# EAGLE design Base Arduino clone (EAGLE 7.1.0)
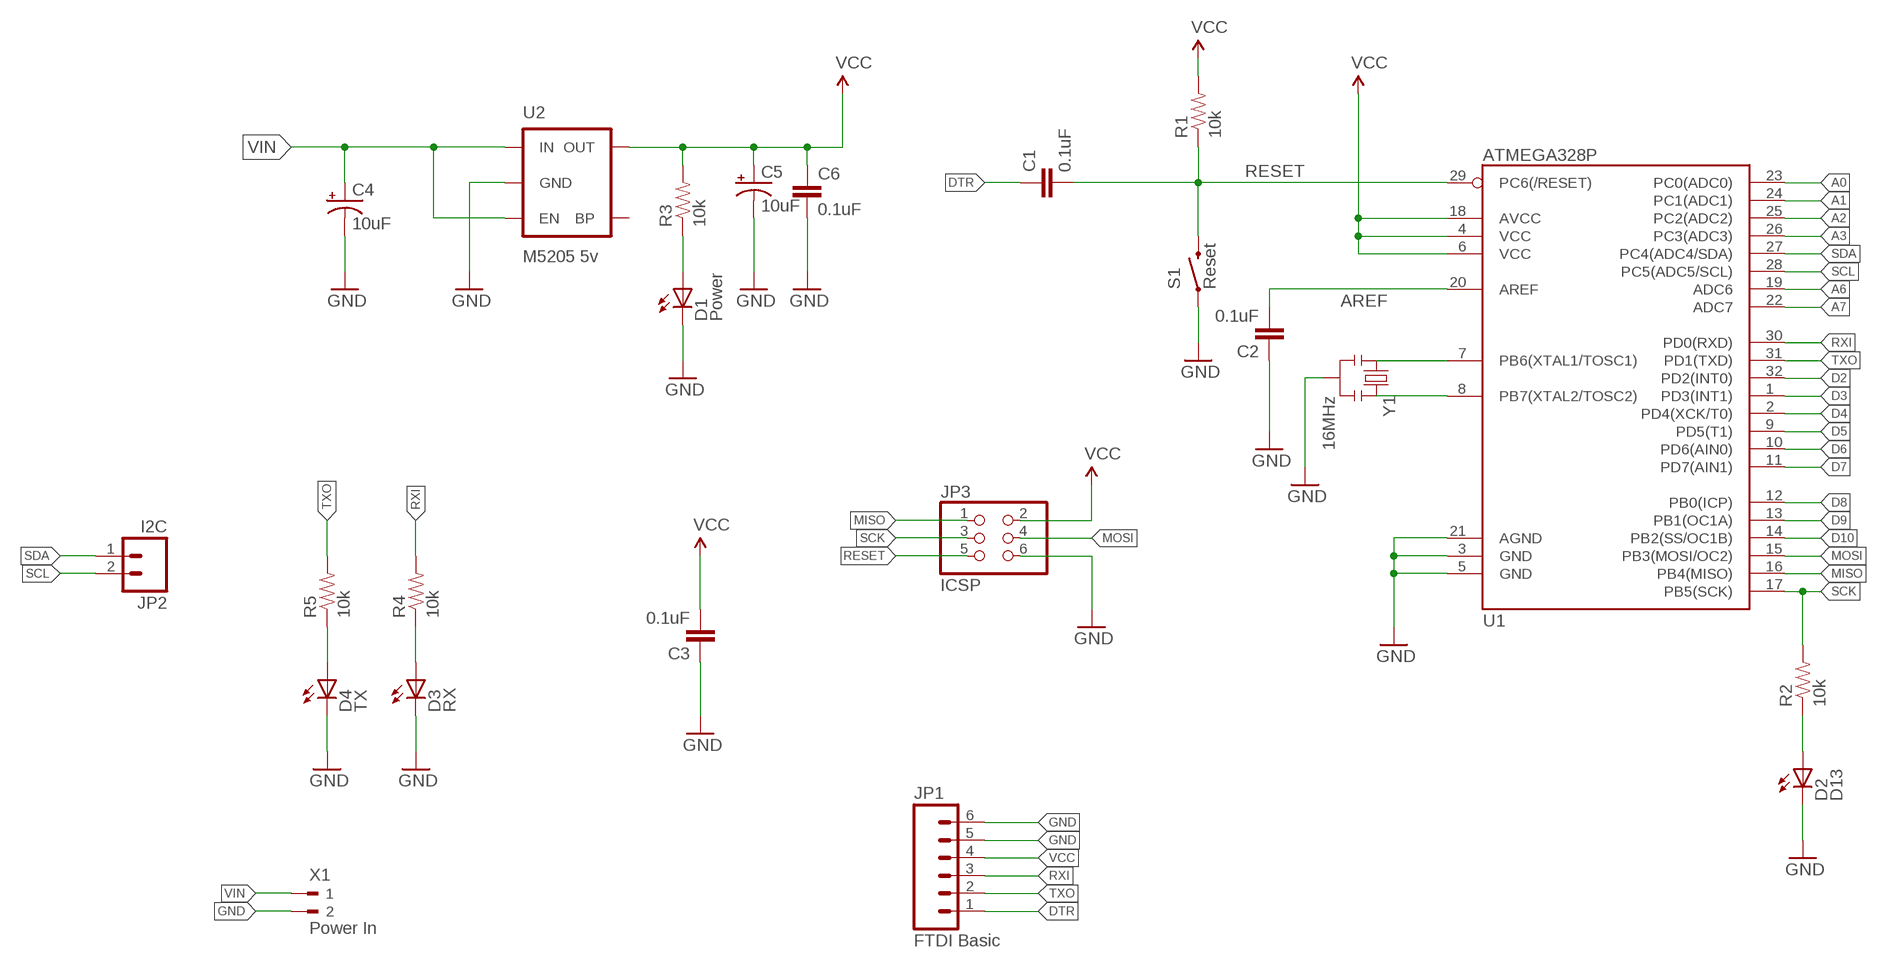
[diagram p0: schematic, sheet 1]

## Parts
C1  0.1uF  CAP0603-CAP  [0603-CAP]
C2  0.1uF  CAP0603-CAP  [0603-CAP]
C3  0.1uF  CAP0603-CAP  [0603-CAP]
C4  10uF  CAP_POL1206  [EIA3216]
C5  10uF  CAP_POL1206  [EIA3216]
C6  0.1uF  CAP0603-CAP  [0603-CAP]
D1  Power  LED-RED0603  [LED-0603]
D2  D13  LED-RED0603  [LED-0603]
D3  RX  LED-GREEN0603  [LED-0603]
D4  TX  LED-RED0603  [LED-0603]
JP1  FTDI Basic  M06SIP  [1X06]
JP2  I2C  M02PTH  [1X02]
JP3  ICSP  PINHD-2X3  [2X03]
R1  10k  RESISTOR0603-RES  [0603-RES]
R2  10k  RESISTOR0603-RES  [0603-RES]
R3  10k  RESISTOR0603-RES  [0603-RES]
R4  10k  RESISTOR0603-RES  [0603-RES]
R5  10k  RESISTOR0603-RES  [0603-RES]
S1  Reset  SWITCH-MOMENTARY-2SMD  [TACTILE_SWITCH_SMD]
U1  ATMEGA328P  ATMEGA328_SMT  [TQFP32-08]
U2  M5205 5v  MIC52055V  [SOT23-5]
X1  Power In  180G-2  [180G-2]
Y1  16MHz  RESONATOR16MHZ  [RESONATOR-SMD]

## Nets
A0: U1.23(PC0(ADC0))
A1: U1.24(PC1(ADC1))
A2: U1.25(PC2(ADC2))
A3: U1.26(PC3(ADC3))
A6: U1.19(ADC6)
A7: U1.22(ADC7)
AREF: C2.2 U1.20(AREF)
D2: U1.32(PD2(INT0))
D3: U1.1(PD3(INT1))
D4: U1.2(PD4(XCK/T0))
D5: U1.9(PD5(T1))
D6: U1.10(PD6(AIN0))
D7: U1.11(PD7(AIN1))
D8: U1.12(PB0(ICP))
D9: U1.13(PB1(OC1A))
D10: U1.14(PB2(SS/OC1B))
DTR: C1.1 JP1.1
GND: C2.1 C3.1 C4.C(-) C5.C(-) C6.2 D1.C D2.C D3.C D4.C JP1.5 JP1.6 JP3.6 S1.1 U1.3(GND) U1.5(GND) U1.21(AGND) U2.2(GND) X1.2 Y1.2
MISO: JP3.1 U1.16(PB4(MISO))
MOSI: JP3.4 U1.15(PB3(MOSI/OC2))
N$1: U1.7(PB6(XTAL1/TOSC1)) Y1.1
N$2: U1.8(PB7(XTAL2/TOSC2)) Y1.3
N$3: D1.A R3.1
N$4: D2.A R2.1
N$5: D3.A R4.1
N$6: D4.A R5.1
RESET: C1.2 JP3.5 R1.1 S1.3 U1.29(PC6(/RESET))
RXI: JP1.3 R4.2 U1.30(PD0(RXD))
SCK: JP3.3 R2.2 U1.17(PB5(SCK))
SCL: JP2.2 U1.28(PC5(ADC5/SCL))
SDA: JP2.1 U1.27(PC4(ADC4/SDA))
TXO: JP1.2 R5.2 U1.31(PD1(TXD))
VCC: C3.2 C5.A(+) C6.1 JP1.4 JP3.2 R1.2 R3.2 U1.4(VCC) U1.6(VCC) U1.18(AVCC) U2.5(OUT)
VIN: C4.A(+) U2.1(IN) U2.3(EN) X1.1
Unconnected: U2.4(BP)

## Library data of the parts
C1-C3 C6 = SparkFun-Passives:CAP: Capacitor Standard 0603 ceramic capacitor, and 0.1" leaded capacitor.
C4 C5 = SparkFun-Passives:CAP_POL: Capacitor Polarized These are standard SMD and PTH capacitors. Normally 10uF, 47uF, and 100uF in electrolytic and tantalum varieties. Always verify the external diameter of the through hole cap, it varies with capacity, voltage, and manufacturer. The EIA devices should be standard.
D1 D2 D4 = SparkFun-LED:LED-RED: Assorted Red LEDs LilyPad 1206- DIO-09912 1206- DIO-00809 0603- DIO-00819; PROD_ID: DIO-00819; VALUE: RED
D3 = SparkFun-LED:LED-GREEN: Various green LEDs Green LEDs used in SFE Production 0603- DIO-00821 LARGE- DIO-00862 LILYPAD- DIO-09910; PROD_ID: DIO-00821; VALUE: GREEN
JP1 = SparkFun-Connectors:M06: Header 6 Standard 6-pin 0.1" header. Use with straight break away headers (SKU : PRT-00116), right angle break away headers (PRT-00553), swiss pins (PRT-00743), machine pins (PRT-00117), and female headers (PRT-00115). Molex polarized connector foot print use with SKU : PRT-08094 with associated crimp pins and housings. NOTES ON THE VARIANTS LOCK and LOCK_LONGPADS... This footprint was designed to help hold the alignment of a through-hole component (i.e. 6-pin header) while soldering it into place. You may notice that each hole has been shifted either up or down by 0.005 of an inch from it's more standard position (which is a perfectly straight line). This slight alteration caused the pins (the squares in the middle) to touch the edges of the holes. Because they are alternating, it causes a "brace" to hold the component in place. 0.005 has proven to be the perfect amount of "off-center" position when using our standard breakaway headers. Although looks a little odd when you look at the bare footprint, once you have a header in there, the alteration is very hard to notice. Also,if you push a header all the way into place, it is covered up entirely on the bottom side. This idea of altering the position of holes to aid alignment will be further integrated into the Sparkfun Library for other footprints. It can help hold any component with 3 or more connection pins.
JP2 = SparkFun-Connectors:M02: Standard 2-pin 0.1" header. Use with - straight break away headers ( PRT-00116) - right angle break away headers (PRT-00553) - swiss pins (PRT-00743) - machine pins (PRT-00117) - female headers (PRT-00115) Molex polarized connector foot print use with: PRT-08233 with associated crimp pins and housings. 2.54_SCREWTERM for use with PRT-10571. 3.5mm Screw Terminal footprints for PRT-08084 5mm Screw Terminal footprints for use with PRT-08433
JP3 = SparkFun-Connectors:PINHD-2X3: PIN HEADER
R1-R5 = SparkFun-Passives:RESISTOR: Resistor Basic schematic elements and footprints for 0603, 1206, and PTH resistors.
S1 = SparkFun-Electromechanical:SWITCH-MOMENTARY-2: Various NO switches- pushbuttons, reed, etc; PROD_ID: SWCH-08247
U1 = SparkFun-DigitalIC:ATMEGA328_SMT: 32-Pin Atmega328 part Commonly used on Arduino compatible boards Available in QFP and QFN packages TQFP is IC-09069 QFN is non-stock; PROD_ID: IC-09069
U2 = SparkFun-PowerIC:MIC5205: MIC5205 150mA vreg 3.3V - VREG-00822 5V - VREG-00823; PROD_ID: VREG-00823
X1 = con-weidmueller-sl35:180G-2: WEIDMUELLER CLAMP CONNECTOR; OC_FARNELL: unknown; OC_NEWARK: unknown
Y1 = SparkFun-FreqCtrl:RESONATOR: Resonator Small SMD resonator. Used, eg, on the Arduino Pro/ Pro Mini boards. 8MHz- XTAL-08895 16MHz- XTAL-08900; PROD_ID: XTAL-08900

## Board
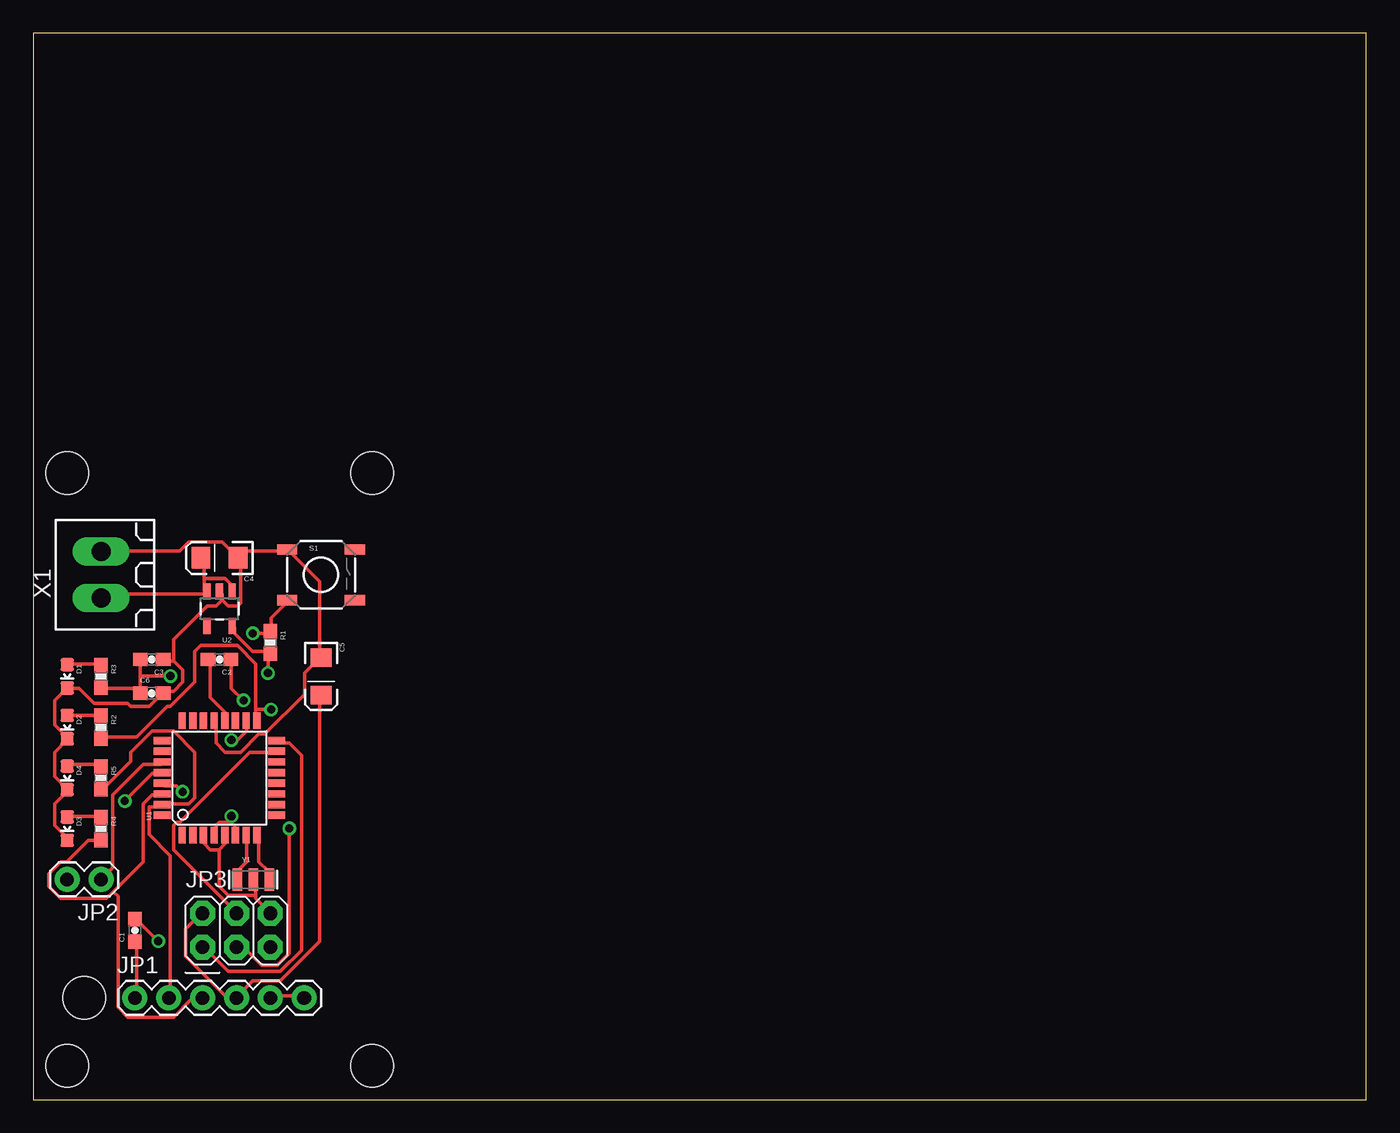
[diagram p1: board, top side]
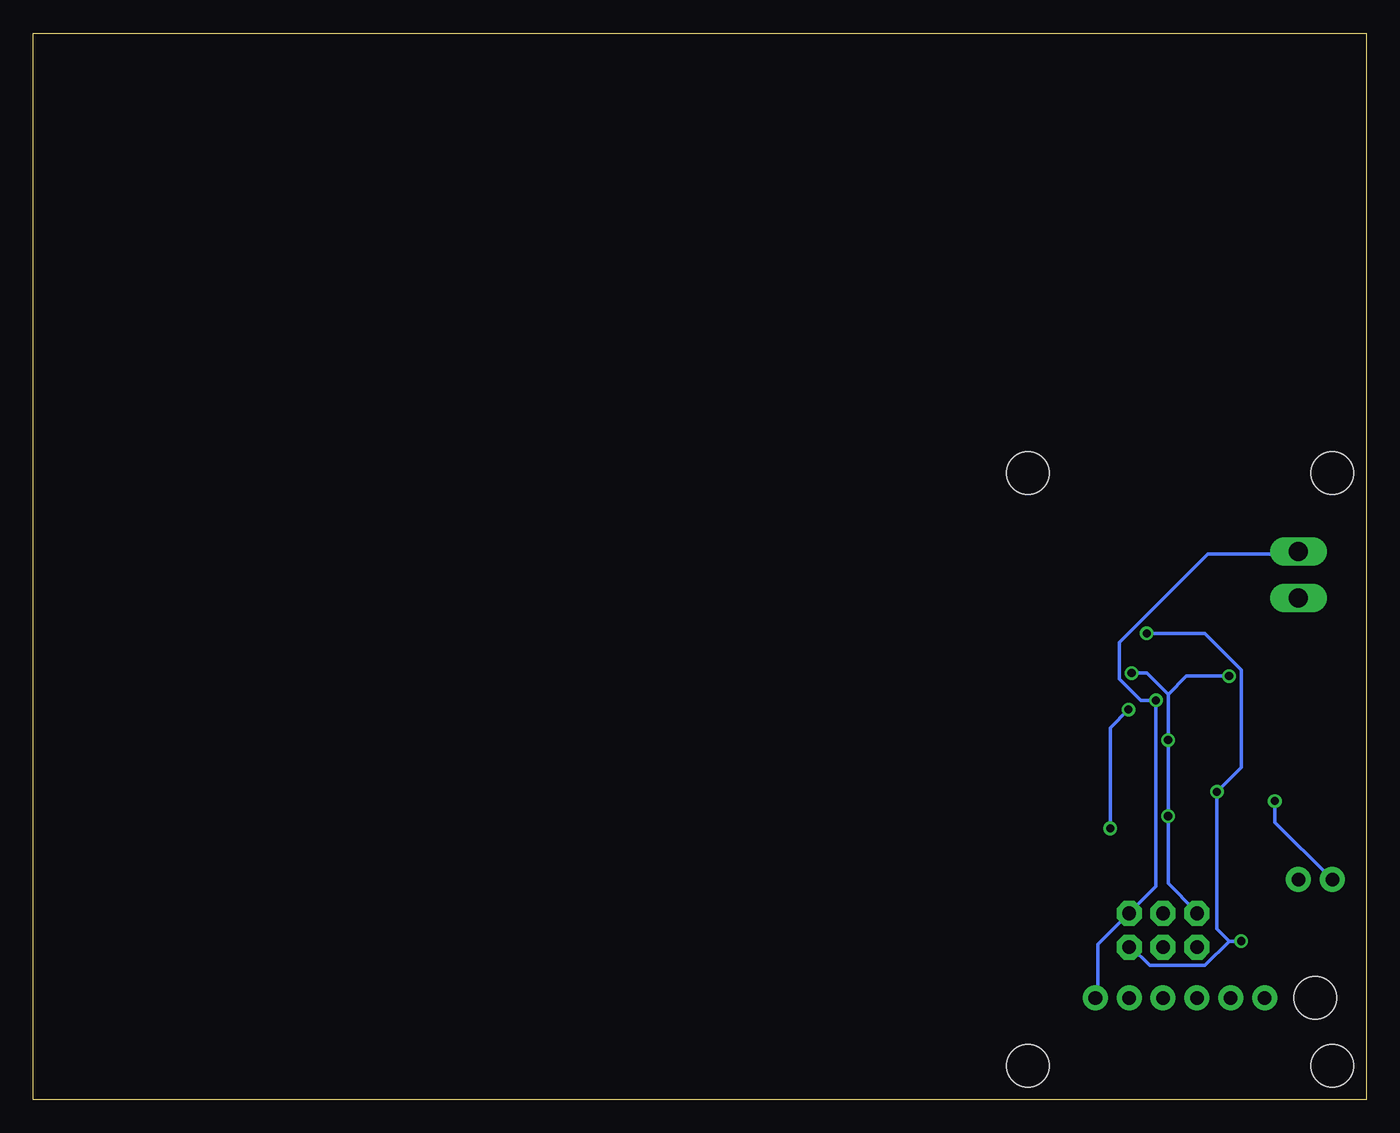
[diagram p2: board, bottom side, seen from below]

Size 100 x 80 mm. Coordinates in mm from the lower left corner, seen from the top.
Outline: 0,0 100,0 100,80 0,80 0,0
Copper layers (1*16): Top 0.035mm / dielectric 1.5mm / Bottom 0.035mm
Design rules "default": minimum track width 10mil, minimum drill 24mil, track to track 8mil, track to pad 8mil, pad to pad 8mil, via to via 8mil, smd to smd 8mil, copper to edge 40mil, drill to drill 8mil, minimum pad ring 10mil, minimum via ring 8mil, stop-mask expansion 4mil, vias tented up to drill 0mil, thermal gap 10mil
Holes 3.2 mm at 2.54,2.54 25.4,2.54 2.54,46.99 25.4,46.99 3.81,7.62

### Footprints (pad centres in the part's own frame; a part is rotated, then mirrored left to right if it is on the bottom)
0603-CAP = smd 1.1 x 1: 1 -0.85,0; 2 0.85,0
EIA3216 = smd 1.4 x 1.6: A 1.4,0; C -1.4,0
LED-0603 = smd 1 x 1: A 0,-0.877; C 0,0.877
1X06 = drill 1.016 pad 1.88: 1 0,0; 2 2.54,0; 3 5.08,0; 4 7.62,0; 5 10.16,0; 6 12.7,0
1X02 = drill 1.016 pad 1.88: 1 0,0; 2 2.54,0
2X03 = drill 1.016 pad 1.88 octagon: 1 -2.54,-1.27; 2 -2.54,1.27; 3 0,-1.27; 4 0,1.27; 5 2.54,-1.27; 6 2.54,1.27
0603-RES = smd 1.1 x 1: 1 -0.85,0; 2 0.85,0
TACTILE_SWITCH_SMD = smd 1.524 x 0.762: 1 -2.54,1.905; 2 2.54,1.905; 3 -2.54,-1.905; 4 2.54,-1.905
TQFP32-08 = smd 1.27 x 0.559: 1 -4.293,2.8; 2 -4.293,2; 3 -4.293,1.2; 4 -4.293,0.4; 5 -4.293,-0.4; 6 -4.293,-1.2; 7 -4.293,-2; 8 -4.293,-2.8; 17 4.293,-2.8; 18 4.293,-2; 19 4.293,-1.2; 20 4.293,-0.4; 21 4.293,0.4; 22 4.293,1.2; 23 4.293,2; 24 4.293,2.8 | smd 0.559 x 1.27: 9 -2.8,-4.293; 10 -2,-4.293; 11 -1.2,-4.293; 12 -0.4,-4.293; 13 0.4,-4.293; 14 1.2,-4.293; 15 2,-4.293; 16 2.8,-4.293; 25 2.8,4.293; 26 2,4.293; 27 1.2,4.293; 28 0.4,4.293; 29 -0.4,4.293; 30 -1.2,4.293; 31 -2,4.293; 32 -2.8,4.293
SOT23-5 = smd 0.55 x 1.2: 1 -0.95,-1.3; 2 0,-1.3; 3 0.95,-1.3; 4 0.95,1.3; 5 -0.95,1.3
180G-2 = drill 1.422 long: 1 -1.75,0; 2 1.75,0
RESONATOR-SMD = smd 0.7 x 1.7: 1 -1.2,0; 2 0,0; 3 1.2,0

### Placement (x,y rotation side)
C1  7.62,12.7 90 top
C2  13.97,33.02 180 top
C3  8.89,33.02 180 top
C4  13.97,40.64 180 top
C5  21.59,31.75 270 top
C6  8.89,30.48 0 top
D1  2.54,31.75 180 top
D2  2.54,27.94 180 top
D3  2.54,20.32 180 top
D4  2.54,24.13 180 top
JP1  7.62,7.62 0 top
JP2  5.08,16.51 180 top
JP3  15.24,12.7 0 top
R1  17.78,34.29 270 top
R2  5.08,27.94 270 top
R3  5.08,31.75 270 top
R4  5.08,20.32 270 top
R5  5.08,24.13 270 top
S1  21.59,39.37 0 top
U1  13.97,24.13 90 top
U2  13.97,36.83 180 top
X1  5.08,39.37 90 top
Y1  16.51,16.51 0 top

### Tracks (layer width: path | path; a pad name or v marks a point on that pad's centre or on a via)
AREF
  Top 0.254: C2.2 13.26,32.92 13.26,30.18 14.4,29.03 14.4,28.57 U1.20
DTR
  Top 0.254: C1.1 7.77,11.66 7.77,7.77 JP1.1
GND  (via drill 0.61)
  Top 0.254: JP1.5 17.83,7.77 20.12,7.77 JP1.6 | 13.95,18.75 13.26,18.75 12.8,19.2 12.8,19.66 U1.3 | 13.95,18.75 14.4,19.2 14.4,19.66 U1.5 | v15.77,29.95 14.86,30.86 14.86,32.92 C2.1 | 16.69,15.32 16.69,15.09 17.6,14.17 JP3.6 | 16.69,15.32 16.69,16.46 Y1.2 | 13.95,18.75 13.95,16 14.63,15.32 16.69,15.32 | U1.21 13.72,28.35 13.72,26.75 14.4,26.06 15.54,26.06 16.92,27.43 17.37,27.43 20.34,30.4 20.34,32 21.49,33.15 C5.C 21.49,33.38 21.49,38.86 19.2,41.15 S1.1 18.97,41.15 16,41.15 15.54,40.69 C4.C | D3.C 2.52,19.66 1.6,20.57 1.6,22.17 2.52,23.09 D4.C 2.52,23.32 1.6,24.23 1.6,26.06 2.52,26.98 D2.C 2.52,27.2 1.6,28.12 1.6,29.95 2.52,30.86 D1.C 2.74,30.86 3.43,30.86 4.57,29.72 7.09,29.72 7.32,29.49 8.69,29.49 9.6,30.4 C6.2 9.83,30.63 10.52,30.63 11.2,31.32 11.2,32.23 10.52,32.92 | 10.52,32.92 9.83,32.92 C3.1 | 14.17,37.49 14.17,37.95 U2.2 | 14.17,37.49 14.63,37.03 15.32,37.03 15.54,37.26 15.54,40.46 C4.C | 10.52,32.92 10.52,34.52 13.03,37.03 13.72,37.03 14.17,37.49 | X1.2 5.26,41.15 10.97,41.15 11.66,41.83 14.17,41.83 15.32,40.69 C4.C
  Bottom 0.254: JP1.6 20.12,7.77 20.12,11.66 17.83,13.95 JP3.6 17.6,14.17 15.77,16 v15.77,29.95 16.92,29.95 18.52,31.55 18.52,34.29 11.89,40.92 5.26,40.92 X1.2
MISO
  Top 0.254: U1.16 18.29,26.75 19.2,26.75 20.12,25.83 20.12,11.2 18.52,9.6 14.63,9.6 12.8,11.43 JP3.1
MOSI
  Top 0.254: U1.15 18.06,26.06 16.23,26.06 10.97,20.8 10.74,20.8 10.52,20.57 10.52,18.75 15.09,14.17 JP3.4
N$1
  Top 0.254: U1.7 16,19.66 16,17.83 15.32,17.14 15.32,16.69 Y1.1
N$2
  Top 0.254: U1.8 16.92,19.66 16.92,17.83 17.6,17.14 17.6,16.69 Y1.3
N$3
  Top 0.254: D1.A 2.74,32.69 5.03,32.69 R3.1
N$4
  Top 0.254: D2.A 2.74,28.8 5.03,28.8 R2.1
N$5
  Top 0.254: D3.A 2.74,21.26 5.03,21.26 R4.1
N$6
  Top 0.254: D4.A 2.74,25.15 5.03,25.15 R5.1
RESET  (via drill 0.61)
  Top 0.254: S1.3 18.97,37.26 17.83,36.12 17.83,35.2 R1.1 17.6,34.98 v16.46,34.98 | v9.37,11.89 7.77,13.49 C1.2 | v11.2,23.09 10.74,23.55 9.83,23.55 U1.29
  Bottom 0.254: 10.29,11.89 v9.37,11.89 | 10.29,11.89 12.12,10.06 16.23,10.06 17.6,11.43 JP3.5 | 10.29,11.89 11.2,12.8 v11.2,23.09 9.37,24.92 9.37,32.23 12.12,34.98 v16.46,34.98
RXI
  Top 0.254: 5.99,15.6 8.23,17.83 8.23,22.17 8.91,22.86 9.6,22.86 U1.30 | 5.99,15.6 5.49,15.09 2.06,15.09 1.14,16 1.14,16.92 2.06,17.83 2.52,17.83 4.12,19.43 5.03,19.43 R4.2 | JP1.3 12.57,7.54 11.89,7.54 10.52,6.17 7.09,6.17 6.35,6.91 6.35,15.24 5.99,15.6
SCK  (via drill 0.61)
  Top 0.254: 16.69,29.26 16.69,28.57 U1.17 | 16.69,29.26 16.69,32.69 15.32,34.06 12.57,34.06 12.12,33.6 12.12,31.32 10.29,29.49 10.06,29.49 7.77,27.2 5.26,27.2 R2.2 | JP3.3 15.77,11.43 17.14,10.06 18.29,10.06 19.2,10.97 v19.2,20.34 | 16.69,29.26 v17.83,29.26
  Bottom 0.254: v19.2,20.34 19.2,27.89 v17.83,29.26
SCL  (via drill 0.61)
  Top 0.254: v6.86,22.4 8.91,24.46 9.6,24.46 U1.28
  Bottom 0.254: v6.86,22.4 6.86,20.8 2.74,16.69 JP2.2
SDA
  Top 0.254: JP2.1 5.94,17.37 5.94,22.86 8.23,25.15 9.6,25.15 U1.27
TXO
  Top 0.254: R5.2 5.26,23.32 7.32,25.38 7.32,26.06 8.91,27.66 10.52,27.66 12.12,26.06 12.12,22.63 11.66,22.17 9.83,22.17 U1.31 9.6,21.95 8.69,21.95 8.69,19.89 10.29,18.29 10.29,7.77 JP1.2
VCC  (via drill 0.61)
  Top 0.254: C5.A 21.49,30.18 21.49,11.89 18.52,8.91 16.46,8.91 15.32,7.77 JP1.4 15.09,7.77 14.4,7.77 11.43,10.74 11.43,12.8 12.57,13.95 JP3.2 | 8,31.77 8,32.92 C3.2 | 8,31.77 8,30.86 | 8,30.86 8,30.63 C6.1 8,30.86 | 8,30.86 5.26,30.86 R3.2 | U2.5 15.09,35.43 15.09,34.98 16.46,33.6 17.6,33.6 R1.2 17.6,33.38 v17.6,32 | 14.86,20.8 13.95,20.8 13.72,20.57 13.72,19.89 U1.4 | 14.86,20.8 15.09,20.57 15.09,19.89 U1.6 | v14.86,26.98 15.32,26.98 16,27.66 16,28.35 U1.18 | v14.86,21.26 14.86,20.8 | v10.29,31.77 8,31.77
  Bottom 0.254: JP3.2 12.8,14.17 14.86,16.23 v14.86,21.26 v14.86,26.98 14.86,30.4 | v17.6,32 16.46,32 14.86,30.4 | v10.29,31.77 13.49,31.77 14.86,30.4
VIN
  Top 0.254: 12.8,39.09 12.8,40.23 12.57,40.46 C4.A | 12.8,39.09 12.8,38.18 U2.3 12.8,37.95 5.49,37.95 5.26,37.72 X1.1 | 12.8,39.09 14.4,39.09 14.86,38.63 14.86,38.18 U2.1